# Altium schematic sheet XbeeBed.SchDoc: XBee Bed
size A4; 21441: QWEQWE
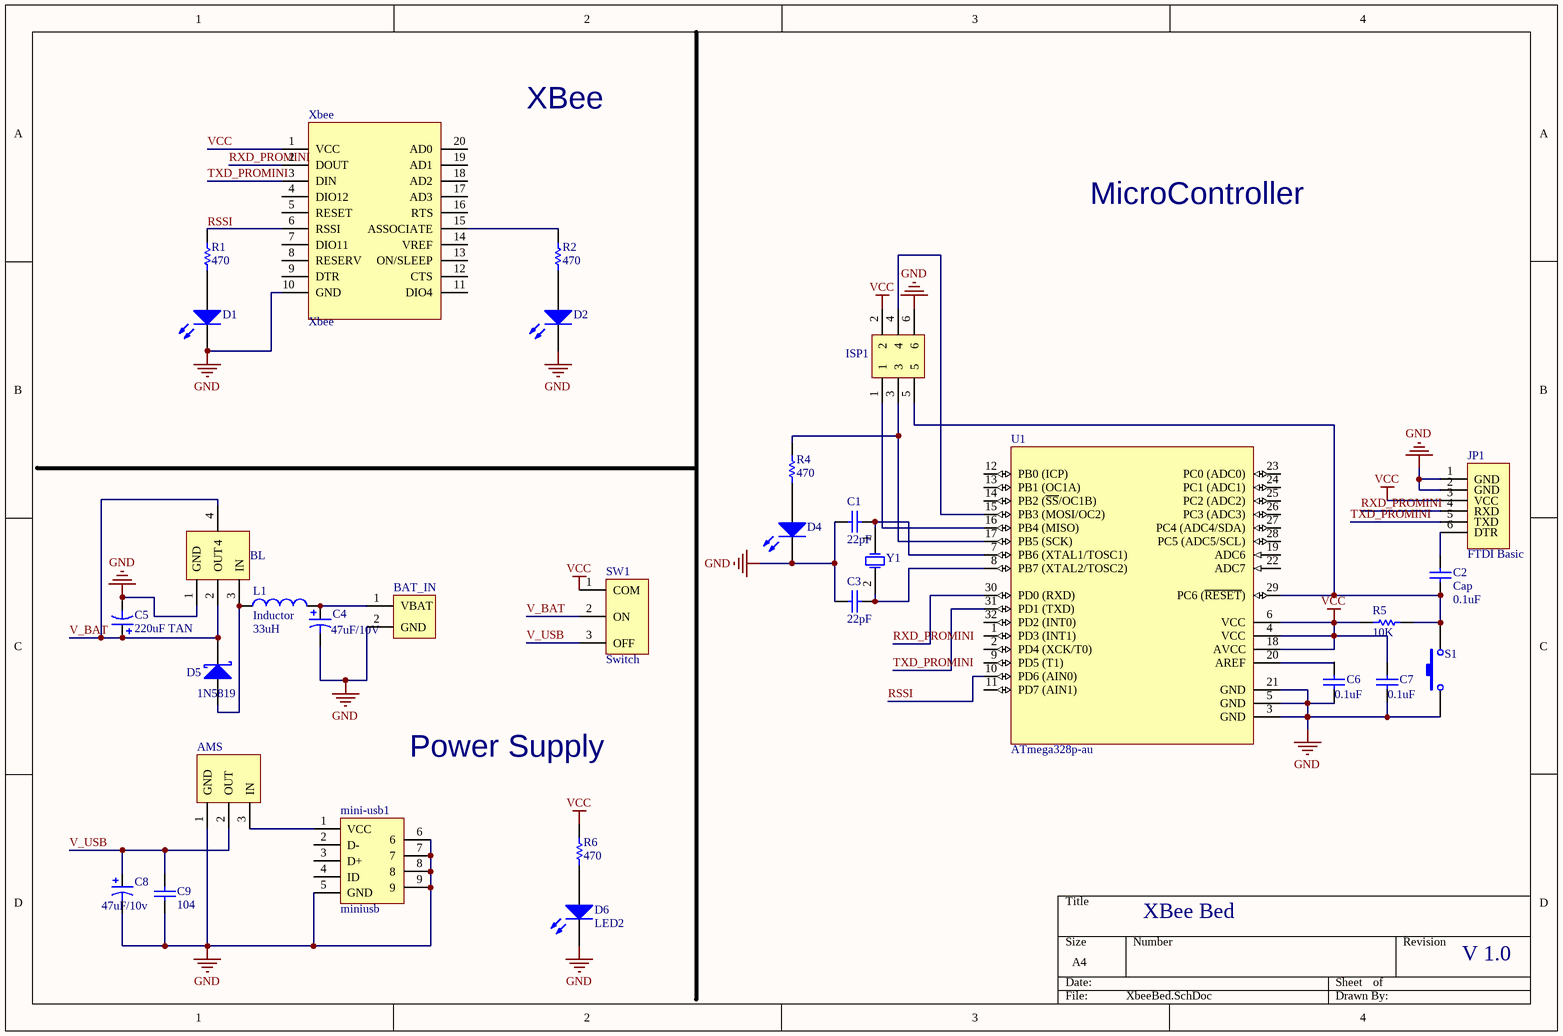
[diagram p0: XbeeBed.SchDoc]

## Parts
AMS  AMS1117-3.3CD  [SOT223]  (value not drawn)
BAT_IN  BATTERY INPUT  [vbat_in]  (value not drawn)
BL  BL8530-331SM  [SOT89]  (value not drawn)
C1  value 22pF  [0805]  (hidden comment: Cap)
C2  Cap  value 0.1uF  [0805]
C3  value 22pF  [0805]  (hidden comment: Cap)
C4  value 47uF/10V  [tan-c type]  (hidden comment: Cap Pol3)
C5  value 220uF TAN  [tan-d type]  (hidden comment: Cap Pol3)
C6  value 0.1uF  [0805]  (hidden comment: Cap)
C7  value 0.1uF  [0805]  (hidden comment: Cap)
C8  value 47uF/10v  [tan-c type]  (hidden comment: Cap Pol3)
C9  value 104  [0805]  (hidden comment: Cap)
D1  LED2  [0805]  (value not drawn)
D2  LED2  [0805]  (value not drawn)
D4  LED2  [0805]  (value not drawn)
D5  1N5819  [1n5819]
D6  LED2  [0805]
ISP1  ISP INTERFACE  [icsp]  (value not drawn)
JP1  FTDI Basic  [ftdi-basic]
L1  Inductor  value 33uH  [33uh-cd43]
mini-usb1  miniusb  [mini USB]
R1  value 470  [0805]  (hidden comment: Res1)
R2  value 470  [0805]  (hidden comment: Res1)
R4  value 470  [0805]  (hidden comment: Res1)
R5  value 10K  [0805]  (hidden comment: Res1)
R6  value 470  [0805]  (hidden comment: Res1)
S1  SW-PB  [sw-pb]  (value not drawn)
SW1  Switch  [switch]
U1  ATmega328p-au  [atmega328]
Xbee  Xbee  [xbee]
Y1  XTAL  [8MHz]  (value not drawn)

## Nets
GND: AMS.1(GND) BAT_IN.2(GND) BL.1(GND) C1.2 C3.2 C4.2 C5.2 C6.1 C7.1 C8.2 C9.2 D1.2(K) D2.2(K) D4.2(K) D6.2(K) ISP1.6 JP1.1(GND) JP1.2(GND) mini-usb1.5(GND) mini-usb1.6 mini-usb1.7 mini-usb1.8 mini-usb1.9 S1.1 U1.3(GND) U1.5(GND) U1.21(GND) Xbee.10(GND)
VCC: C7.2 ISP1.2 JP1.3(VCC) R5.2 R6.1 SW1.1(COM) U1.4(VCC) U1.6(VCC) U1.18(AVCC) Xbee.1(VCC)
RSSI: R1.1 U1.10(PD6_(AIN0)) Xbee.6(RSSI)
RXD_PROMINI: JP1.4(RXD) U1.30(PD0_(RXD)) Xbee.2(DOUT)
TXD_PROMINI: JP1.5(TXD) U1.31(PD1_(TXD)) Xbee.3(DIN)
V_BAT: BL.2(OUT) BL.4 C5.1 D5.2(K) SW1.2(ON)
V_USB: AMS.2(OUT) C8.1 C9.1 SW1.3(OFF)
NetAMS_3: AMS.3(IN) mini-usb1.1(VCC)
NetBAT_IN_1: BAT_IN.1(VBAT) C4.1 L1.2
NetBL_3: BL.3(IN) D5.1(A) L1.1
NetC1_1: C1.1 U1.7(PB6_(XTAL1/TOSC1)) Y1.1(OSC1)
NetC2_1: C2.1 ISP1.5 R5.1 S1.2 U1.29(PC6_(~{RESET}))
NetC2_2: C2.2 JP1.6(DTR)
NetC3_1: C3.1 U1.8(PB7_(XTAL2/TOSC2)) Y1.2(OSC2)
NetC6_2: C6.2 U1.20(AREF)
NetD1_1: D1.1(A) R1.2
NetD2_1: D2.1(A) R2.2
NetD4_1: D4.1(A) R4.2
NetD6_1: D6.1(A) R6.2
NetISP1_1: ISP1.1 U1.16(PB4_(MISO))
NetISP1_3: ISP1.3 R4.1 U1.17(PB5_(SCK))
NetISP1_4: ISP1.4 U1.15(PB3_(MOSI/OC2))
NetR2_1: R2.1 Xbee.15(ASSOCIATE)

Not connected (* = marked no-connect by the designer): mini-usb1 2(D-) 3(D+) 4(ID); U1 1(PD3_(INT1)) 2(PD4_(XCK/T0)) 9(PD5_(T1)) 11(PD7_(AIN1)) 12(PB0_(ICP)) 13(PB1_(OC1A)) 14(PB2_(~{SS}/OC1B)) 19(ADC6) 22(ADC7) 23(PC0_(ADC0)) 24(PC1_(ADC1)) 25(PC2_(ADC2)) 26(PC3_(ADC3)) 27(PC4_(ADC4/SDA)) 28(PC5_(ADC5/SCL)) 32(PD2_(INT0)); Xbee 4(DIO12) 5(RESET) 7(DIO11) 8(RESERV) 9(DTR) 11(DIO4) 12(CTS) 13(ON/SLEEP) 14(VREF) 16(RTS) 17(AD3) 18(AD2) 19(AD1) 20(AD0)

## Notes on the sheet
- XBee
- MicroController
- Power Supply
- V 1.0

## Library data of the parts
BAT_IN = BAT_IN
BL = BL8530-331SM: pin to pad: 4>0
C1-C3 C6 C7 C9 = Cap: Capacitor; Published: 8-Jun-2000; LatestRevisionDate: 17-Jul-2002; LatestRevisionNote: Re-released for DXP Platform.; PackageReference: RAD-0.3; Publisher: Altium Limited
C4 C5 C8 = Cap Pol3: Polarized Capacitor (Surface Mount); Published: 8-Jun-2000; LatestRevisionDate: 17-Jul-2002; LatestRevisionNote: Re-released for DXP Platform.; PackageReference: C0805; Publisher: Altium Limited
D1 D2 D4 D6 = LED2: Typical RED, GREEN, YELLOW, AMBER GaAs LED; Published: 8-Jun-2000; LatestRevisionDate: 17-Jul-2002; LatestRevisionNote: Re-released for DXP Platform.; PackageDocument: Feb-2002; PackageReference: 3.2X1.6X1.1; Publisher: Altium Limited
D5 = Diode 11DQ03: Schottky Rectifier; Published: 8-Jun-2000; LatestRevisionDate: 17-Jul-2002; LatestRevisionNote: Re-released for DXP Platform.; DatasheetDocument: Dec-1997; PackageReference: DO-204AL; Publisher: Altium Limited; Code_JEDEC: DO-204-AL; ComponentLink1Description: Manufacturer Link; ComponentLink1URL: http://www.irf.com/; ComponentLink2Description: Datasheet; ComponentLink2URL: http://www.irf.com/product-info/datasheets/data/11dq03.pdf
ISP1 = ISP
L1 = Inductor: Code_IEC: 1005; Published: 8-Jun-2000; LatestRevisionDate: 17-Jul-2002; LatestRevisionNote: Re-released for DXP Platform.; PackageReference: 0402-A; Publisher: Altium Limited; Code_JEITA: 0402
mini-usb1 = Mini-Usb
R1 R2 R4-R6 = Res1: Resistor; Published: 8-Jun-2000; LatestRevisionDate: 17-Jul-2002; LatestRevisionNote: Re-released for DXP Platform.; PackageReference: AXIAL-0.3; Publisher: Altium Limited
S1 = SW-PB: Switch; Published: 24-Mar-1999; LatestRevisionDate: 17-Jul-2002; LatestRevisionNote: Re-released for DXP Platform.; PackageReference: SPST-2; Publisher: Altium Limited
SW1 = SW
U1 = ATmega8-16AC: 8-Bit AVR Microcontroller with 8K Bytes of In-System Programmable Flash Memory; Published: 17-Sep-2003; LatestRevisionDate: 13-Apr-2006; LatestRevisionNote: IPC-7351 Footprint Added.; DatasheetVersion: 2486H-AVR-09/02; PackageVersion: revB, Oct-2001; PackageReference: 32A; Publisher: Altium Limited; PackageDescription: 32-Pin Thin Quad Flat Pack 0.8 mm Pitch; Code_JEDEC: MS-026-ABA; ComponentLink1Description: Manufacturer Link; ComponentLink1URL: http://www.atmel.com; ComponentLink2Description: Datasheet; ComponentLink2URL: http://www.atmel.com/dyn/resources/prod_documents/doc2486.pdf
Xbee = Component_1
Y1 = XTAL: Crystal Oscillator; Published: 8-Jun-2000; LatestRevisionDate: 17-Jul-2002; LatestRevisionNote: Re-released for DXP Platform.; PackageReference: R38; Publisher: Altium Limited